# EAGLE schematic schematic-1 (EAGLE 7.2.0)
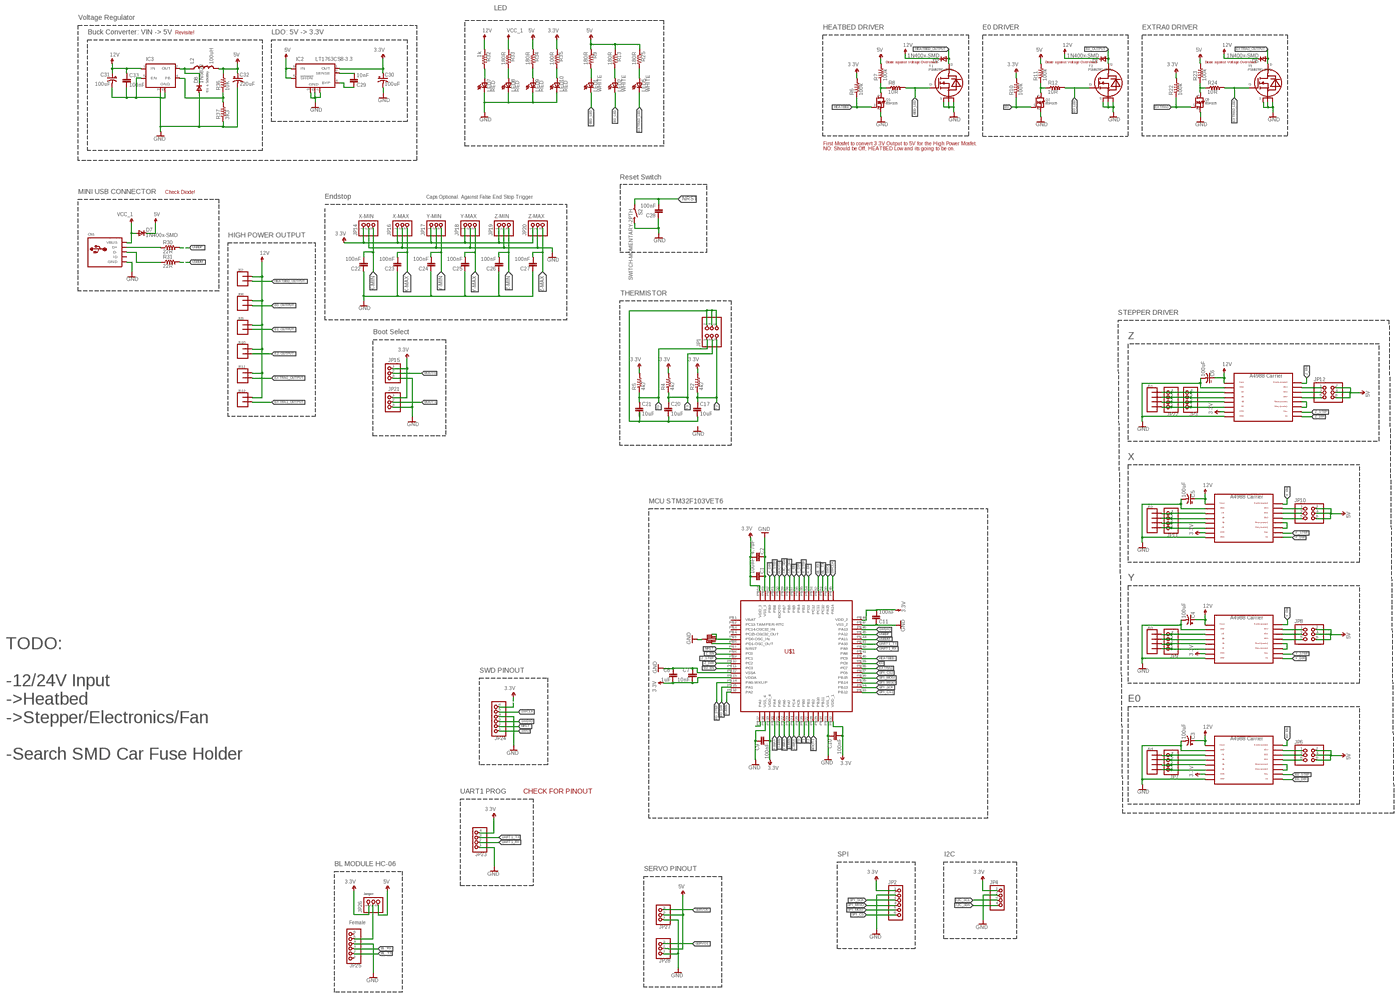
[diagram p0: schematic, sheet 1, overview]
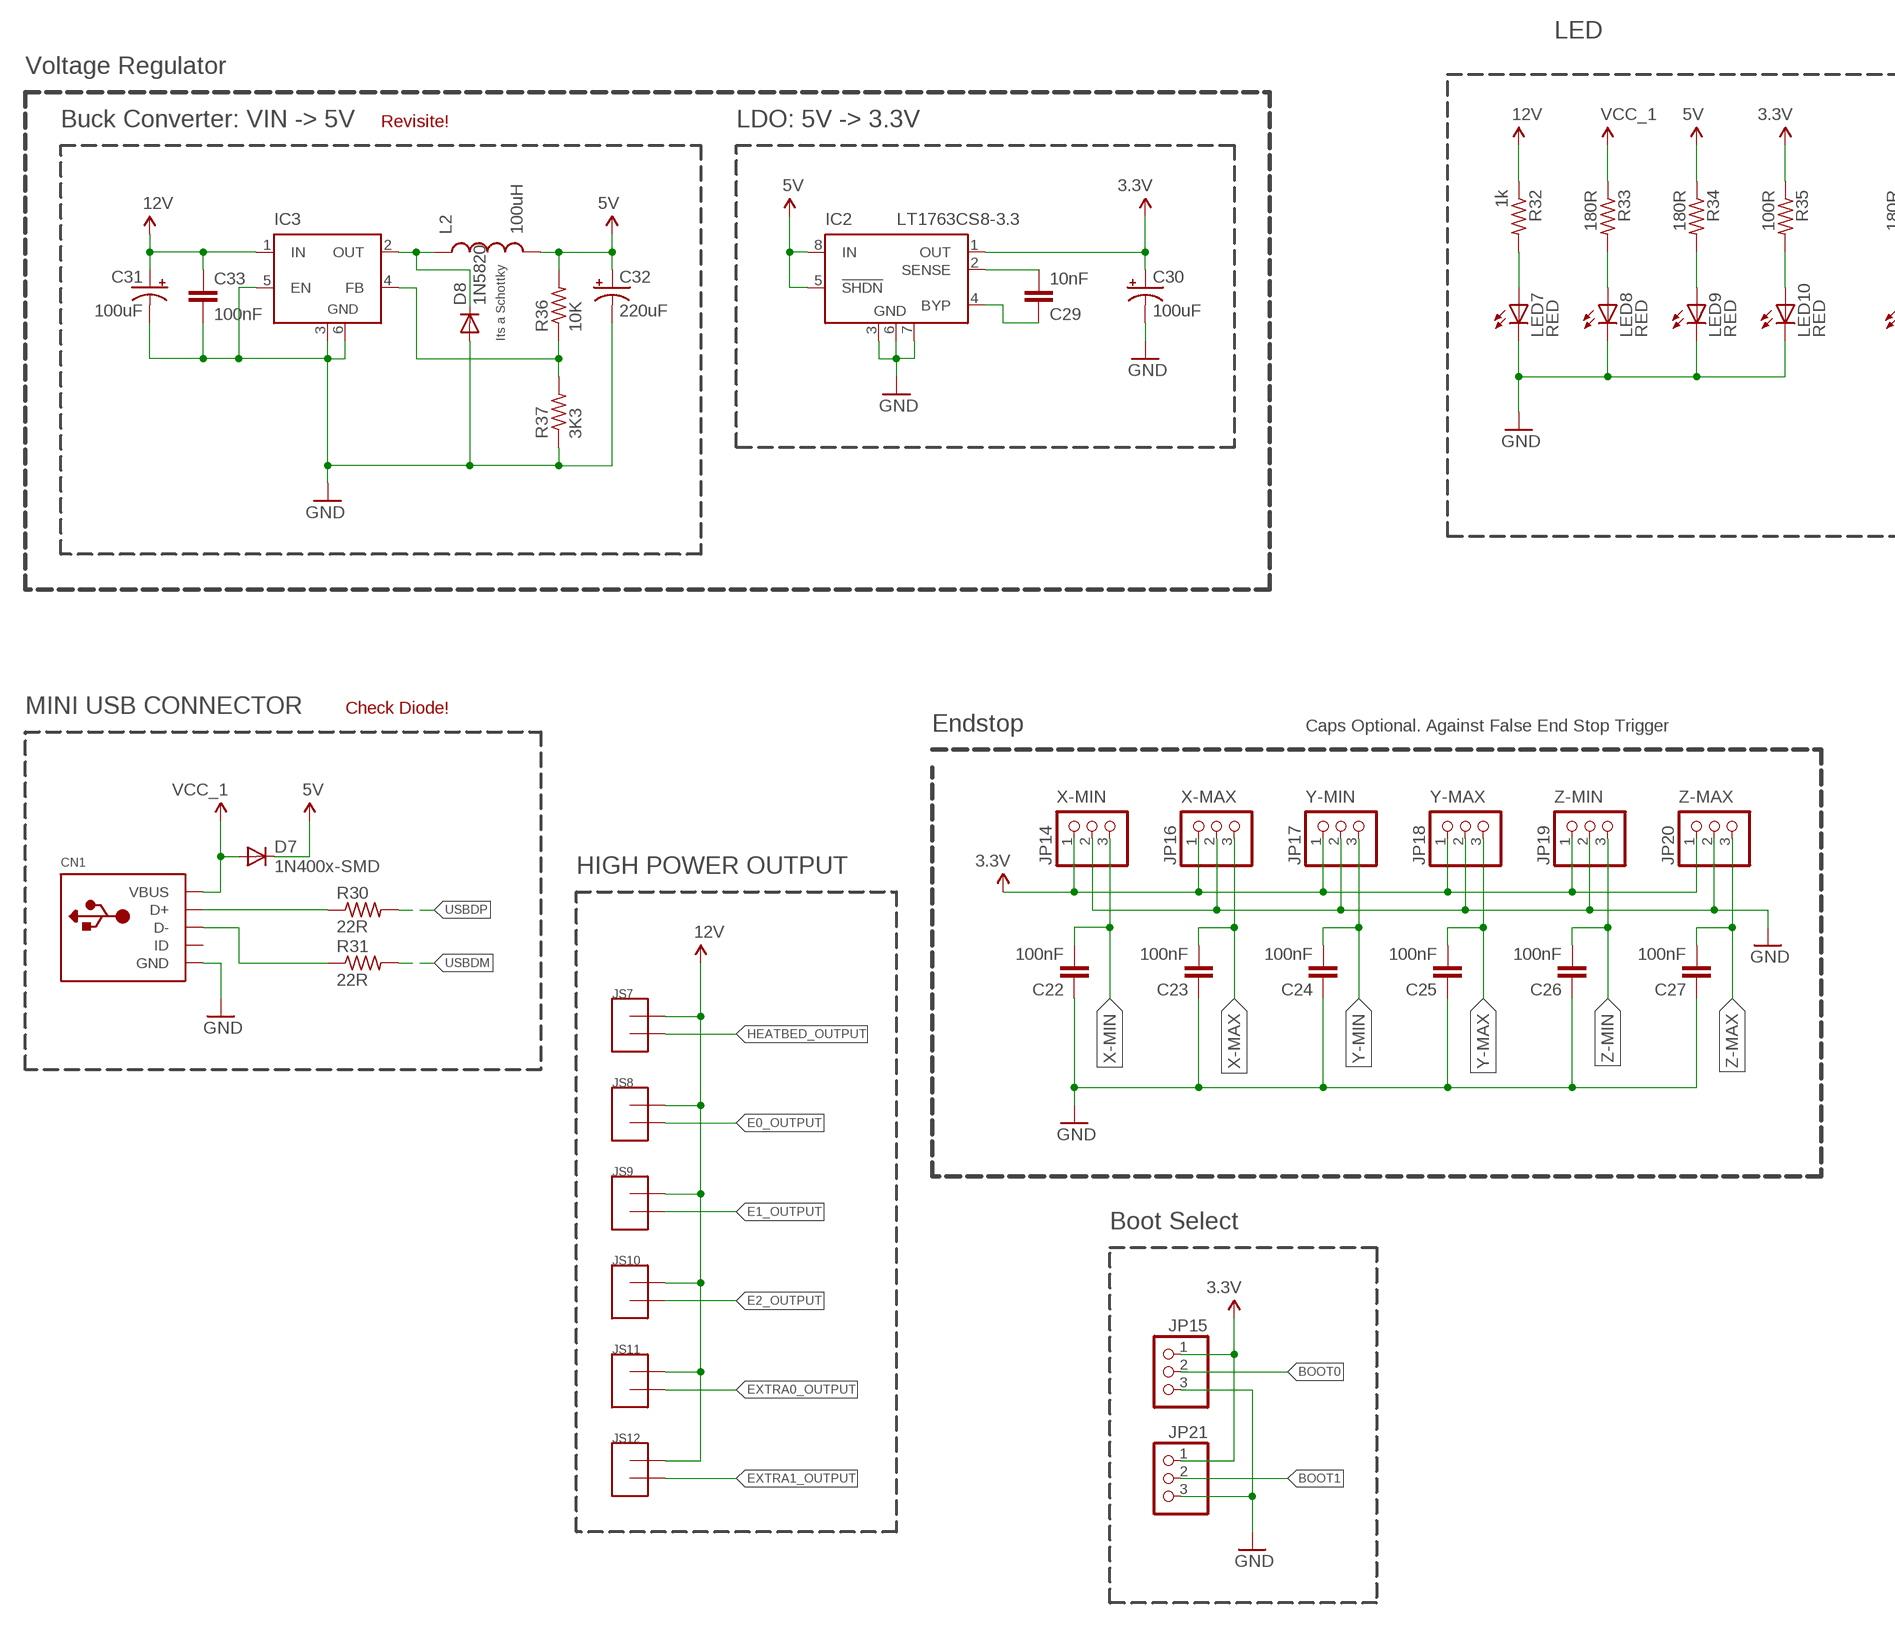
[diagram p1: schematic, sheet 1, part 1 of 4]
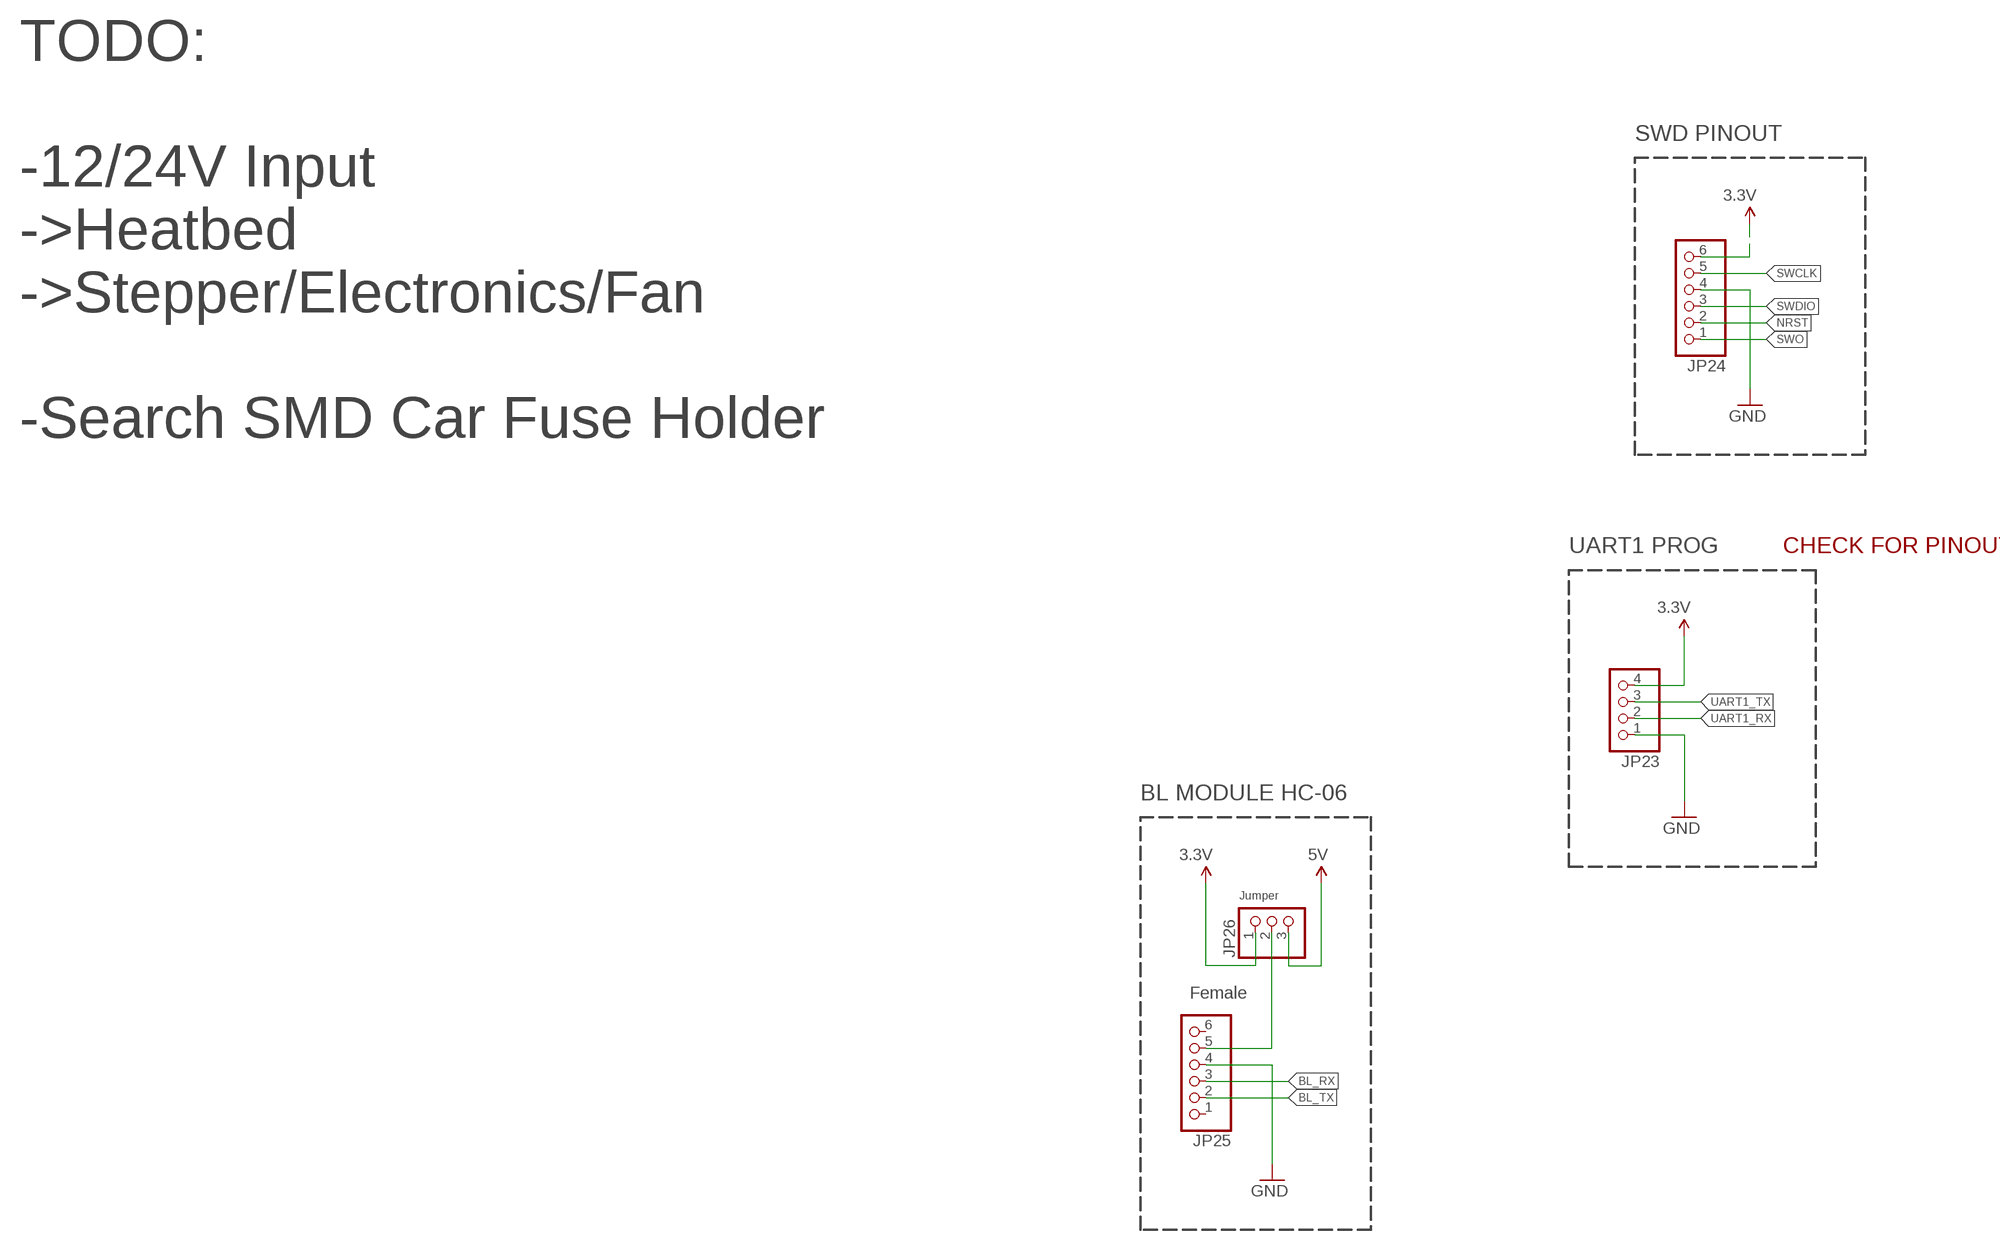
[diagram p2: schematic, sheet 1, part 2 of 4]
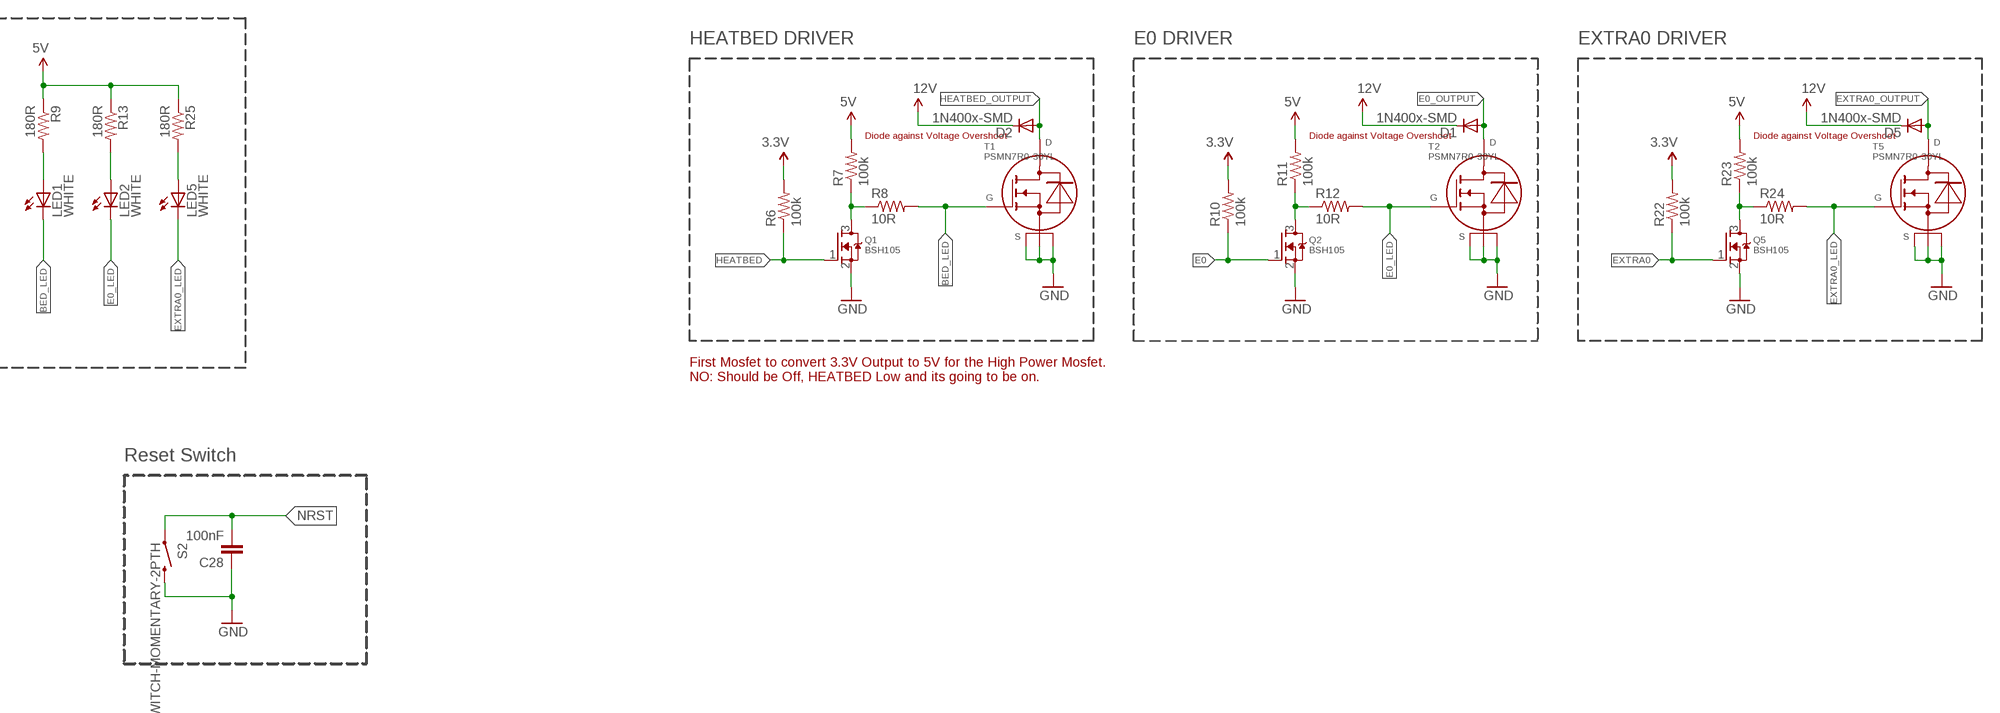
[diagram p3: schematic, sheet 1, part 3 of 4]
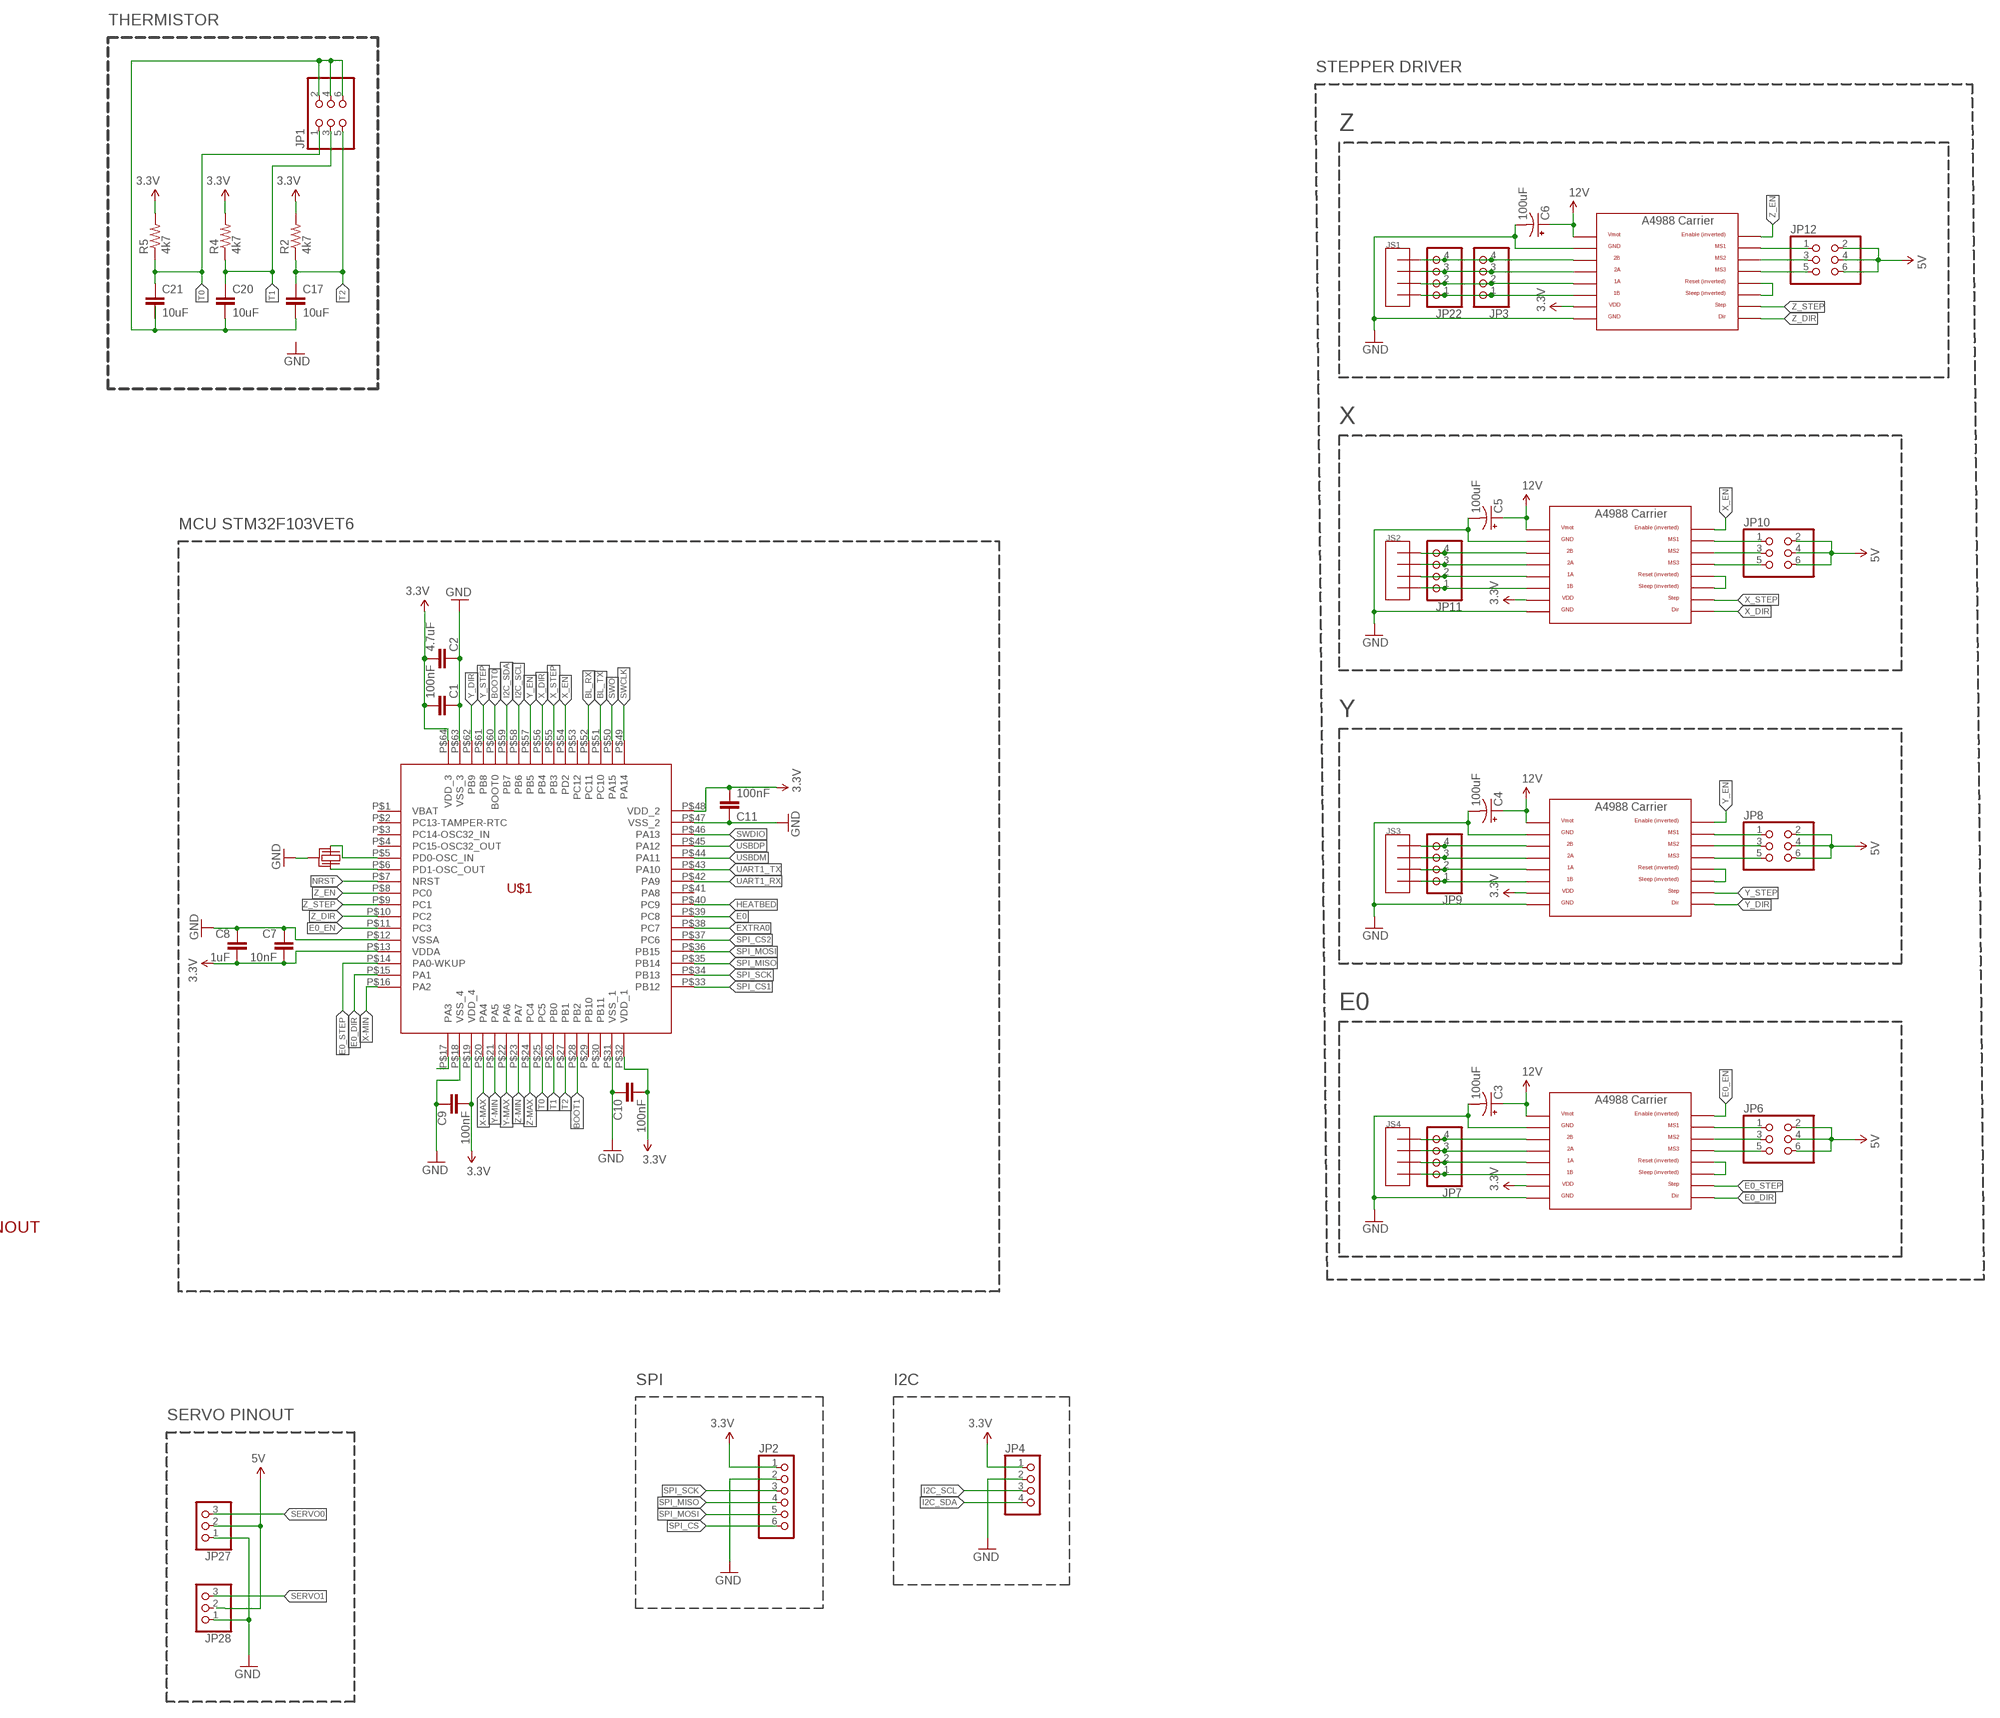
[diagram p4: schematic, sheet 1, part 4 of 4]

## Parts
C1  100nF  C-EUC0805K  [C0805K]
C2  4.7uF  C-EUC0805K  [C0805K]
C3  100uF  CAP_POLD  [PANASONIC_D]
C4  100uF  CAP_POLD  [PANASONIC_D]
C5  100uF  CAP_POLD  [PANASONIC_D]
C6  100uF  CAP_POLD  [PANASONIC_D]
C7  10nF  C-EUC0805K  [C0805K]
C8  1uF  C-EUC0805K  [C0805K]
C9  100nF  C-EUC0805K  [C0805K]
C10  100nF  C-EUC0805K  [C0805K]
C11  100nF  C-EUC0805K  [C0805K]
C17  10uF  C-EUC0805K  [C0805K]
C20  10uF  C-EUC0805K  [C0805K]
C21  10uF  C-EUC0805K  [C0805K]
C22  100nF  C-EUC0805K  [C0805K]
C23  100nF  C-EUC0805K  [C0805K]
C24  100nF  C-EUC0805K  [C0805K]
C25  100nF  C-EUC0805K  [C0805K]
C26  100nF  C-EUC0805K  [C0805K]
C27  100nF  C-EUC0805K  [C0805K]
C28  100nF  C-EUC0805K  [C0805K]
C29  10nF  C-EUC0805K  [C0805K]
C30  100uF  CAP_POLD  [PANASONIC_D]
C31  100uF  CAP_POLD  [PANASONIC_D]
C32  220uF  CAP_POLD  [PANASONIC_D]
C33  100nF  C-EUC0805K  [C0805K]
CN1  USBMINIB  [USB-MINIB]
D1  1N400x-SMD  DIODE-DO-214AC  [DO-214AC]
D2  1N400x-SMD  DIODE-DO-214AC  [DO-214AC]
D5  1N400x-SMD  DIODE-DO-214AC  [DO-214AC]
D7  1N400x-SMD  DIODE-DO-214AC  [DO-214AC]
D8  1N5820  DIODE-DO-214AC  [DO-214AC]
IC2  LT1763CS8-3.3  [SOIC8]
IC3  LM2596S  [TO263-5]
JP1  PINHD-2X3  [2X03]
JP2  PINHD-1X6  [1X06]
JP3  PINHD-1X4  [1X04]
JP4  PINHD-1X4  [1X04]
JP6  PINHD-2X3  [2X03]
JP7  PINHD-1X4  [1X04]
JP8  PINHD-2X3  [2X03]
JP9  PINHD-1X4  [1X04]
JP10  PINHD-2X3  [2X03]
JP11  PINHD-1X4  [1X04]
JP12  PINHD-2X3  [2X03]
JP14  PINHD-1X3  [1X03]
JP15  PINHD-1X3  [1X03]
JP16  PINHD-1X3  [1X03]
JP17  PINHD-1X3  [1X03]
JP18  PINHD-1X3  [1X03]
JP19  PINHD-1X3  [1X03]
JP20  PINHD-1X3  [1X03]
JP21  PINHD-1X3  [1X03]
JP22  PINHD-1X4  [1X04]
JP23  PINHD-1X4  [1X04]
JP24  PINHD-1X6  [1X06]
JP25  PINHD-1X6  [1X06]
JP26  PINHD-1X3  [1X03]
JP27  PINHD-1X3  [1X03]
JP28  PINHD-1X3  [1X03]
JS1  PINHEAD-4PIN  [PINHEAD-4PIN]
JS2  PINHEAD-4PIN  [PINHEAD-4PIN]
JS3  PINHEAD-4PIN  [PINHEAD-4PIN]
JS4  PINHEAD-4PIN  [PINHEAD-4PIN]
JS7  PINHEAD-2PIN-HP  [PINHEAD-2PIN-HP]
JS8  PINHEAD-2PIN-HP  [PINHEAD-2PIN-HP]
JS9  PINHEAD-2PIN-HP  [PINHEAD-2PIN-HP]
JS10  PINHEAD-2PIN-HP  [PINHEAD-2PIN-HP]
JS11  PINHEAD-2PIN-HP  [PINHEAD-2PIN-HP]
JS12  PINHEAD-2PIN-HP  [PINHEAD-2PIN-HP]
L2  100uH  INDUCTOR0805  [0805]
LED1  WHITE  LEDCHIP-LED0805  [CHIP-LED0805]
LED2  WHITE  LEDCHIP-LED0805  [CHIP-LED0805]
LED5  WHITE  LEDCHIP-LED0805  [CHIP-LED0805]
LED7  RED  LEDCHIP-LED0805  [CHIP-LED0805]
LED8  RED  LEDCHIP-LED0805  [CHIP-LED0805]
LED9  RED  LEDCHIP-LED0805  [CHIP-LED0805]
LED10  RED  LEDCHIP-LED0805  [CHIP-LED0805]
Q1  BSH105  MOSFET-NREFLOW  [SOT23]
Q2  BSH105  MOSFET-NREFLOW  [SOT23]
Q5  BSH105  MOSFET-NREFLOW  [SOT23]
R2  4k7  R-US_R0805  [R0805]
R4  4k7  R-US_R0805  [R0805]
R5  4k7  R-US_R0805  [R0805]
R6  100k  R-US_R0805  [R0805]
R7  100k  R-US_R0805  [R0805]
R8  10R  R-US_R0805  [R0805]
R9  180R  R-US_R0805  [R0805]
R10  100k  R-US_R0805  [R0805]
R11  100k  R-US_R0805  [R0805]
R12  10R  R-US_R0805  [R0805]
R13  180R  R-US_R0805  [R0805]
R22  100k  R-US_R0805  [R0805]
R23  100k  R-US_R0805  [R0805]
R24  10R  R-US_R0805  [R0805]
R25  180R  R-US_R0805  [R0805]
R30  22R  R-US_R0805  [R0805]
R31  22R  R-US_R0805  [R0805]
R32  1k  R-US_R0805  [R0805]
R33  180R  R-US_R0805  [R0805]
R34  180R  R-US_R0805  [R0805]
R35  100R  R-US_R0805  [R0805]
R36  10K  R-US_R0805  [R0805]
R37  3K3  R-US_R0805  [R0805]
S2  SWITCH-MOMENTARY-2PTH  [TACTILE-PTH]
T1  PSMN7R0-30YL  [SOT669]
T2  PSMN7R0-30YL  [SOT669]
T5  PSMN7R0-30YL  [SOT669]
U$1  STM32F10XR  [LQFP64-10MM]
U$2  CSTCE_G  [GSTCE_G]
U$3  POLOLU_A4983CARRIER  [A4988BREAKOUT]
U$4  POLOLU_A4983CARRIER  [A4988BREAKOUT]
U$5  POLOLU_A4983CARRIER  [A4988BREAKOUT]
U$6  POLOLU_A4983CARRIER  [A4988BREAKOUT]

## Nets
3.3V: C1.2 C2.2 C7.2 C8.2 C9.2 C10.2 C11.2 C30.+ IC2.1(OUT) JP2.1 JP4.1 JP14.1 JP15.1 JP16.1 JP17.1 JP18.1 JP19.1 JP20.1 JP21.1 JP23.4 JP24.6 JP26.1 R2.2 R4.2 R5.2 R6.2 R10.2 R22.2 R35.1 U$1.P$13(VDDA) U$1.P$19(VDD_4) U$1.P$32(VDD_1) U$1.P$48(VDD_2) U$1.P$64(VDD_3) U$3.VDD U$4.VDD U$5.VDD U$6.VDD
5V: C32.+ D7.C IC2.5(!SHDN) IC2.8(IN) JP6.2 JP6.4 JP6.6 JP8.2 JP8.4 JP8.6 JP10.2 JP10.4 JP10.6 JP12.2 JP12.4 JP12.6 JP26.3 L2.2 R7.2 R9.1 R11.2 R13.1 R23.2 R25.1 R34.1 R36.2
12V: C3.+ C4.+ C5.+ C6.+ C31.+ C33.1 D1.C D2.C D5.C IC3.1(IN) JS7.1 JS8.1 JS9.1 JS10.1 JS11.1 JS12.1 R32.1 U$3.VMOT U$4.VMOT U$5.VMOT U$6.VMOT
BED_LED: LED1.C R8.2 T1.4(G)
BL_RX: JP25.3 U$1.P$52(PC11)
BL_TX: JP25.2 U$1.P$51(PC10)
BOOT0: JP15.2 U$1.P$60(BOOT0)
BOOT1: JP21.2 U$1.P$28(PB2)
E0: Q2.1(G) R10.1 U$1.P$39(PC8)
E0_DIR: U$1.P$15(PA1) U$3.DIR
E0_EN: U$1.P$11(PC3) U$3.EN
E0_LED: LED2.C R12.2 T2.4(G)
E0_OUTPUT: D1.A JS8.2 T2.MB(D)
E0_STEP: U$1.P$14(PA0-WKUP) U$3.STEP
E1_OUTPUT: JS9.2
E2_OUTPUT: JS10.2
EXTRA0: Q5.1(G) R22.1 U$1.P$38(PC7)
EXTRA0_LED: LED5.C R24.2 T5.4(G)
EXTRA0_OUTPUT: D5.A JS11.2 T5.MB(D)
EXTRA1_OUTPUT: JS12.2
GND: C1.1 C2.1 C3.- C4.- C5.- C6.- C7.1 C8.1 C9.1 C10.1 C11.1 C22.1 C23.1 C24.1 C25.1 C26.1 C27.1 C28.1 C30.- C31.- C32.- C33.2 CN1.GND D8.A IC2.3(GND) IC2.6(GND) IC2.7(GND) IC3.3(GND) IC3.5(EN) IC3.6(GND) JP2.2 JP4.2 JP14.2 JP15.3 JP16.2 JP17.2 JP18.2 JP19.2 JP20.2 JP21.3 JP23.1 JP24.4 JP25.4 JP27.1 JP28.1 LED7.C LED8.C LED9.C LED10.C Q1.2(S) Q2.2(S) Q5.2(S) R37.1 S2.3 T1.1(S) T1.2(S) T1.3(S) T2.1(S) T2.2(S) T2.3(S) T5.1(S) T5.2(S) T5.3(S) U$1.P$12(VSSA) U$1.P$18(VSS_4) U$1.P$31(VSS_1) U$1.P$47(VSS_2) U$1.P$63(VSS_3) U$2.2 U$3.GND U$3.GND@0(GND) U$4.GND U$4.GND@0(GND) U$5.GND U$5.GND@0(GND) U$6.GND U$6.GND@0(GND)
HEATBED: Q1.1(G) R6.1 U$1.P$40(PC9)
HEATBED_OUTPUT: D2.A JS7.2 T1.MB(D)
I2C_SCL: JP4.3 U$1.P$58(PB6)
I2C_SDA: JP4.4 U$1.P$59(PB7)
N$1: C17.2 C20.2 C21.2 JP1.2 JP1.4 JP1.6
N$2: U$1.P$6(PD1-OSC_OUT) U$2.3
N$3: U$1.P$5(PD0-OSC_IN) U$2.1
N$5: U$1.P$17(PA3)
N$17: JP6.1 U$3.MS1
N$18: JP6.3 U$3.MS2
N$19: JP6.5 U$3.MS3
N$20: U$3.RST U$3.SLP(SLEEP)
N$21: JP7.1 JS4.4 U$3.1B
N$22: JP7.2 JS4.3 U$3.1A
N$23: JP7.3 JS4.2 U$3.2A
N$24: JP7.4 JS4.1 U$3.2B
N$25: JP8.1 U$4.MS1
N$26: JP8.3 U$4.MS2
N$27: JP8.5 U$4.MS3
N$28: U$4.RST U$4.SLP(SLEEP)
N$29: JP9.1 JS3.4 U$4.1B
N$30: JP9.2 JS3.3 U$4.1A
N$31: JP9.3 JS3.2 U$4.2A
N$32: JP9.4 JS3.1 U$4.2B
N$33: JP10.1 U$5.MS1
N$34: JP10.3 U$5.MS2
N$35: JP10.5 U$5.MS3
N$36: U$5.RST U$5.SLP(SLEEP)
N$37: JP11.1 JS2.4 U$5.1B
N$38: JP11.2 JS2.3 U$5.1A
N$39: JP11.3 JS2.2 U$5.2A
N$40: JP11.4 JS2.1 U$5.2B
N$41: JP12.1 U$6.MS1
N$42: JP12.3 U$6.MS2
N$43: JP12.5 U$6.MS3
N$44: U$6.RST U$6.SLP(SLEEP)
N$45: JP3.1 JP22.1 JS1.4 U$6.1B
N$46: JP3.2 JP22.2 JS1.3 U$6.1A
N$47: JP3.3 JP22.3 JS1.2 U$6.2A
N$48: JP3.4 JP22.4 JS1.1 U$6.2B
N$49: LED1.A R9.2
N$51: C29.1 IC2.4(BYP)
N$52: IC3.4(FB) R36.1 R37.2
N$53: CN1.D- R31.1
N$54: CN1.D+ R30.1
N$55: C29.2 IC2.2(SENSE)
N$56: LED7.A R32.2
N$57: LED8.A R33.2
N$58: Q1.3(D) R7.1 R8.1
N$59: D8.C IC3.2(OUT) L2.1
N$60: LED9.A R34.2
N$61: LED10.A R35.2
N$62: JP25.5 JP26.2
N$65: Q5.3(D) R23.1 R24.1
N$67: LED5.A R25.2
N$70: Q2.3(D) R11.1 R12.1
N$73: LED2.A R13.2
N$74: JP27.2 JP28.2 ; supply symbol labelled 5V
NRST: C28.2 JP24.2 S2.1 U$1.P$7(NRST)
SERVO0: JP27.3
SERVO1: JP28.3
SPI_CS: JP2.6
SPI_CS1: U$1.P$33(PB12)
SPI_CS2: U$1.P$37(PC6)
SPI_MISO: JP2.4 U$1.P$35(PB14)
SPI_MOSI: JP2.5 U$1.P$36(PB15)
SPI_SCK: JP2.3 U$1.P$34(PB13)
SWCLK: JP24.5 U$1.P$49(PA14)
SWDIO: JP24.3 U$1.P$46(PA13)
SWO: JP24.1 U$1.P$50(PA15)
T0: C21.1 JP1.1 R5.1 U$1.P$25(PC5)
T1: C20.1 JP1.3 R4.1 U$1.P$26(PB0)
T2: C17.1 JP1.5 R2.1 U$1.P$27(PB1)
UART1_RX: JP23.2 U$1.P$42(PA9)
UART1_TX: JP23.3 U$1.P$43(PA10)
USBDM: R31.2 U$1.P$44(PA11)
USBDP: R30.2 U$1.P$45(PA12)
VCC_1: CN1.VBUS D7.A R33.1
X-MAX: C23.2 JP16.3 U$1.P$20(PA4)
X-MIN: C22.2 JP14.3 U$1.P$16(PA2)
X_DIR: U$1.P$56(PB4) U$5.DIR
X_EN: U$1.P$54(PD2) U$5.EN
X_STEP: U$1.P$55(PB3) U$5.STEP
Y-MAX: C25.2 JP18.3 U$1.P$22(PA6)
Y-MIN: C24.2 JP17.3 U$1.P$21(PA5)
Y_DIR: U$1.P$62(PB9) U$4.DIR
Y_EN: U$1.P$57(PB5) U$4.EN
Y_STEP: U$1.P$61(PB8) U$4.STEP
Z-MAX: C27.2 JP20.3 U$1.P$24(PC4)
Z-MIN: C26.2 JP19.3 U$1.P$23(PA7)
Z_DIR: U$1.P$10(PC2) U$6.DIR
Z_EN: U$1.P$8(PC0) U$6.EN
Z_STEP: U$1.P$9(PC1) U$6.STEP
Unconnected: CN1.ID JP25.1 JP25.6 U$1.P$1(VBAT) U$1.P$2(PC13-TAMPER-RTC) U$1.P$3(PC14-OSC32_IN) U$1.P$4(PC15-OSC32_OUT) U$1.P$29(PB10) U$1.P$30(PB11) U$1.P$41(PA8) U$1.P$53(PC12)

## Notes on the sheet
- LED
- Voltage Regulator
- HEATBED DRIVER | E0 DRIVER | EXTRA0 DRIVER
- Buck Converter: VIN -> 5V | Revisite! | LDO: 5V -> 3.3V
- Diode against Voltage Overshoot | Diode against Voltage Overshoot | Diode against Voltage Overshoot
- Its a Schottky
- First Mosfet to convert 3.3V Output to 5V for the High Power Mosfet.
  NO: Should be Off, HEATBED Low and its going to be on.
- Reset Switch
- MINI USB CONNECTOR | Check Diode!
- Endstop | Caps Optional. Against False End Stop Trigger
- X-MIN | X-MAX | Y-MIN | Y-MAX | Z-MIN | Z-MAX
- HIGH POWER OUTPUT
- THERMISTOR
- STEPPER DRIVER
- Boot Select
- Z
- X
- MCU STM32F103VET6
- Y
- SWD PINOUT
- E0
- TODO:
  
  -12/24V Input 
  ->Heatbed
  ->Stepper/Electronics/Fan
  
  -Search SMD Car Fuse Holder
- UART1 PROG | CHECK FOR PINOUT
- SPI | I2C
- BL MODULE HC-06
- SERVO PINOUT
- Jumper
- Female

## Library data of the parts
C1 C2 C7-C11 C17 C20-C29 C33 = rcl:C-EU: CAPACITOR, European symbol
C3-C6 C30-C32 = SparkFun-Capacitors:CAP_POL: Capacitor Polarized These are standard SMD and PTH capacitors. Normally 10uF, 47uF, and 100uF in electrolytic and tantalum varieties. Always verify the external diameter of the through hole cap, it varies with capacity, voltage, and manufacturer. The EIA devices should be standard.
CN1 = adafruit:USB: USB Connectors USBMINIB - Surface Mount Female Mini-B USB Connector 4UConnector: 06564 By microbuilder.eu Thru-hole RA Female Mini-B USB Connector 4UConnector: 18732 By ladyada.net
D1 D2 D5 D7 D8 = diode:DIODE-: DIODE
IC2 = linear-technology:LT1763CS8: 500mA, Low Noise, LDO Micropower Regulators Source: http://cds.linear.com/docs/Datasheet/1763ff.pdf; MPN: LT1763CS8-3.3; OC_FARNELL: 1273617; OC_NEWARK: 57M6055
IC3 = linear:LM2596S: STEP-DOWN VOLTAGE REGULATOR
JP1 JP6 JP8 JP10 JP12 = pinhead:PINHD-2X3: PIN HEADER
JP2 JP24 JP25 = pinhead:PINHD-1X6: PIN HEADER
JP3 JP4 JP7 JP9 JP11 JP22 JP23 = pinhead:PINHD-1X4: PIN HEADER
JP14-JP21 JP26-JP28 = pinhead:PINHD-1X3: PIN HEADER
JS1-JS4 = STamps:PINHEAD-4PIN
JS7-JS12 = STamps:PINHEAD-2PIN-HP
L2 = SparkFun-Passives:INDUCTOR: Inductors Basic Inductor/Choke - 0603 and 1206. Footprints are not proven and vary greatly between part numbers. INDUCTOR POWER 3.3UH 4.0A SMD 0.197" L x 0.197" W x 0.177" H (5.00mm x 5.00mm x 4.50mm)
LED1 LED2 LED5 LED7-LED10 = adafruit:LED: LED OSRAM: - CHIPLED LG R971, LG N971, LY N971, LG Q971, LY Q971, LO R971, LY R971 LH N974, LH R974 LS Q976, LO Q976, LY Q976 LO Q996 - Hyper CHIPLED LW Q18S LB Q993, LB Q99A, LB R99A - SideLED LS A670, LO A670, LY A670, LG A670, LP A670 LB A673, LV A673, LT A673, LW A673 LH A674 LY A675 LS A676, LA A676, LO A676, LY A676, LW A676 LS A679, LY A679, LG A679 - Hyper Micro SIDELED® LS Y876, LA Y876, LO Y876, LY Y876 LT Y87S - SmartLED LW L88C, LW L88S LB L89C, LB L89S, LG L890 LS L89K, LO L89K, LY L89K LS L896, LA L896, LO L896, LY L896 - TOPLED LS T670, LO T670, LY T670, LG T670, LP T670 LSG T670, LSP T670, LSY T670, LOP T670, LYG T670 LG T671, LOG T671, LSG T671 LB T673, LV T673, LT T673, LW T673 LH T674 LS T676, LA T676, LO T676, LY T676, LB T676, LH T676, LSB T676, LW T676 LB T67C, LV T67C, LT T67C, LS T67K, LO T67K, LY T67K, LW E67C LS E67B, LA E67B, LO E67B, LY E67B, LB E67C, LV E67C, LT E67C LW T67C LS T679, LY T679, LG T679 LS T770, LO T770, LY T770, LG T770, LP T770 LB T773, LV T773, LT T773, LW T773 LH T774 LS E675, LA E675, LY E675, LS T675 LS T776, LA T776, LO T776, LY T776, LB T776 LHGB T686 LT T68C, LB T68C - Hyper Mini TOPLED® LB M676 - Mini TOPLED Santana® LG M470 LS M47K, LO M47K, LY M47K Source: http://www.osram.convergy.de/
Q1 Q2 Q5 = adafruit:MOSFET-N: N-Channel Mosfet 2N7002E - 60V 260mA SOT23 [Digikey: 2N7002ET1GOSTR-ND] - REEL BSH103 - 30V 850mA SOT23 [Digikey: 568-5013-1-ND]
R2 R4-R13 R22-R25 R30-R37 = rcl:R-US_: RESISTOR, American symbol
S2 = SparkFun-Electromechanical:SWITCH-MOMENTARY-2: Various NO switches- pushbuttons, reed, etc; PROD_ID: SWCH-08441
T1 T2 T5 = STamps:PSMN7R0-30YL
U$1 = STM32:STM32F10XR
U$2 = STamps:CSTCE_G
U$3-U$6 = RepRapjr:POLOLU_A4983CARRIER